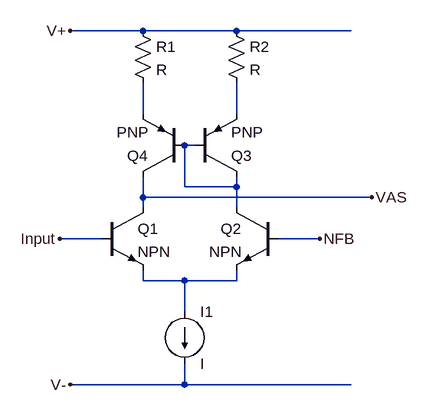
[diagram p0: schematic input_stage_pa.asc]
input_stage_pa.asc, the LTspice schematic file:
Version 4
SHEET 1 880 680
WIRE 160 -160 48 -160
WIRE 304 -160 160 -160
WIRE 480 -160 304 -160
WIRE 160 -32 160 -80
WIRE 304 -32 304 -80
WIRE 240 16 224 16
WIRE 224 80 224 16
WIRE 304 80 304 64
WIRE 304 80 224 80
WIRE 160 96 160 64
WIRE 512 96 160 96
WIRE 160 112 160 96
WIRE 304 112 304 80
WIRE 96 160 32 160
WIRE 432 160 368 160
WIRE 160 224 160 208
WIRE 224 224 160 224
WIRE 304 224 304 208
WIRE 304 224 224 224
WIRE 224 272 224 224
WIRE 224 384 224 352
WIRE 224 384 48 384
WIRE 480 384 224 384
FLAG 48 -160 V+
FLAG 48 384 V-
FLAG 432 160 NFB
FLAG 32 160 Input
FLAG 512 96 VAS
SYMBOL npn 96 112 R0
SYMATTR InstName Q1
SYMBOL npn 368 112 M0
SYMATTR InstName Q2
SYMBOL pnp 240 64 M180
SYMATTR InstName Q3
SYMBOL pnp 224 64 R180
SYMATTR InstName Q4
SYMBOL res 144 -176 R0
SYMATTR InstName R1
SYMBOL res 288 -176 R0
SYMATTR InstName R2
SYMBOL current 224 272 R0
SYMATTR InstName I1

The netlist it stands for:
* input_stage_pa.asc
Q1 VAS Input N004 0 NPN
Q2 N003 NFB N004 0 NPN
Q3 N003 N003 N002 0 PNP
Q4 VAS N003 N001 0 PNP
R1 V+ N001 R
R2 V+ N002 R
I1 N004 V- I
.model NPN NPN
.model PNP PNP
.lib standard.bjt
.backanno
.end